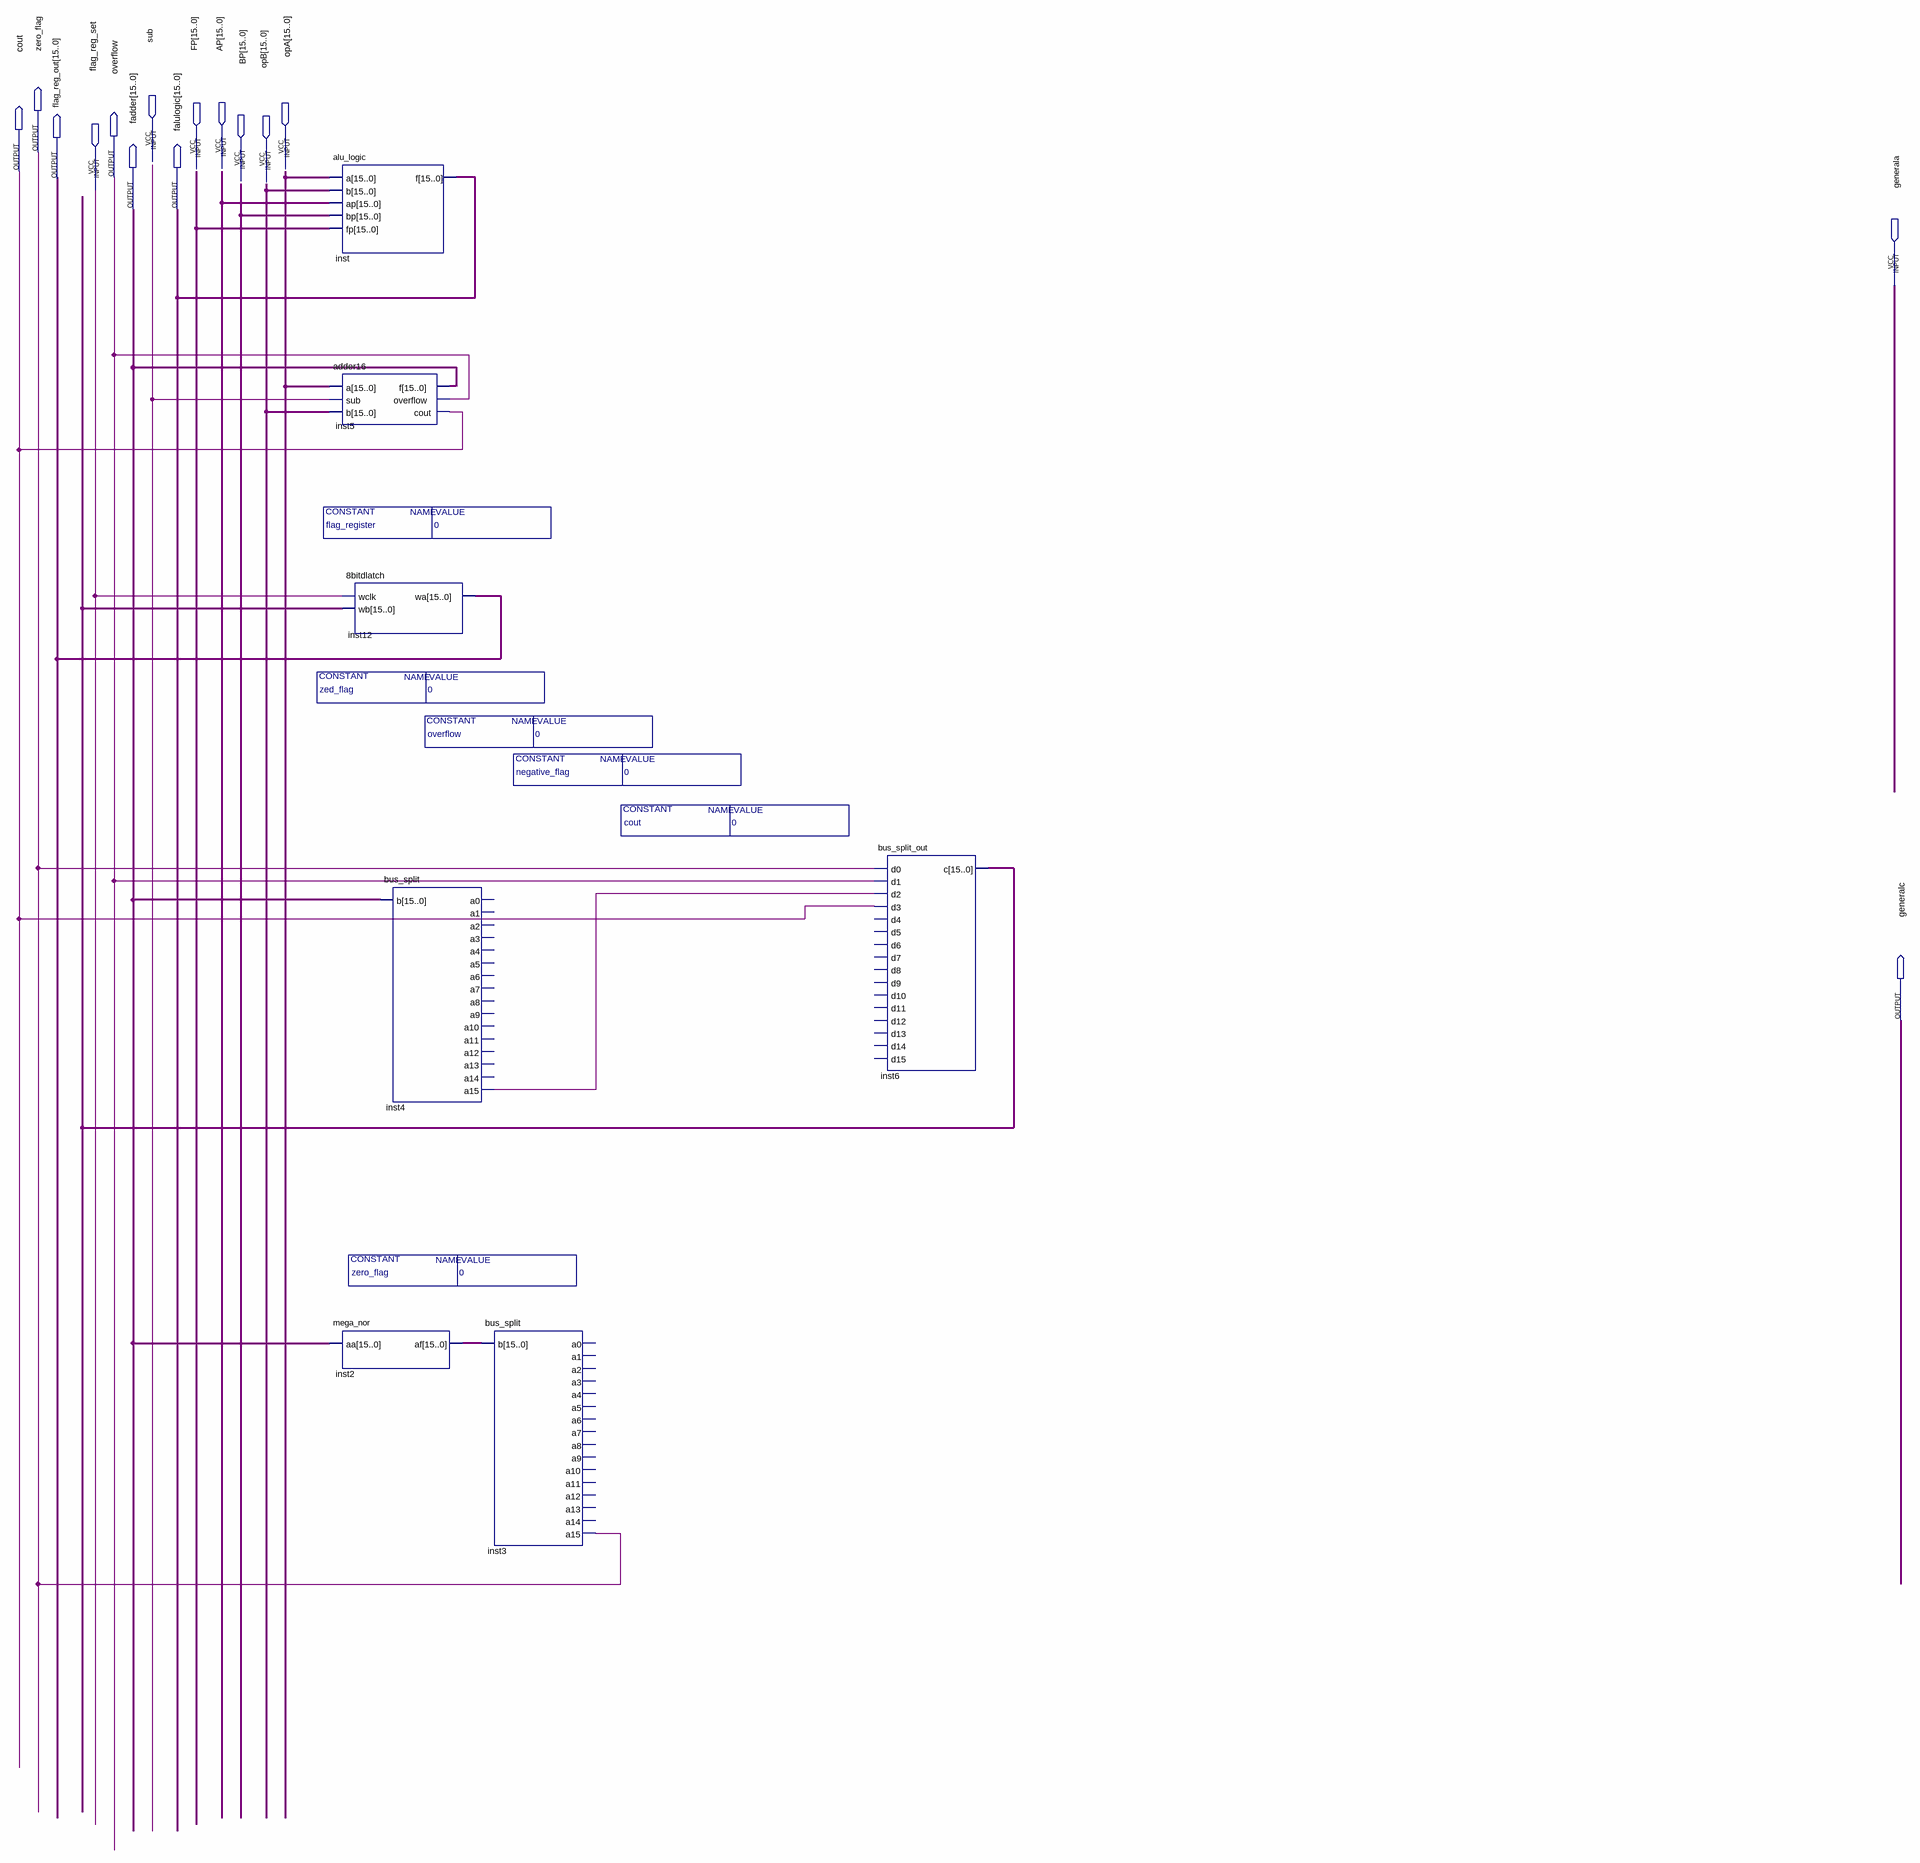
[diagram p0: schematic sheet]
// Quartus schematic alumod.bdf as structural Verilog: 7 symbols, 15 pins
module alumod #(parameter flag_register = 0, parameter zero_flag = 0, parameter negative_flag = 0, parameter overflow = 0, parameter cout = 0, parameter zed_flag = 0) (
  input  sub,
  input  [15:0] FP,
  input  [15:0] AP,
  input  [15:0] opA,
  input  [15:0] BP,
  input  [15:0] opB,
  input  flag_reg_set,
  input  generala,
  output zero_flag,
  output cout,
  output [15:0] flag_reg_out,
  output overflow,
  output [15:0] fadder,
  output [15:0] falulogic,
  output generalc
);

  wire inst4_a15;
  wire [15:0] inst2_af, inst6_c;

  alu_logic inst (.a(opA), .b(opB), .ap(AP), .bp(BP), .fp(FP), .f(falulogic));
  adder16 inst5 (.a(opA), .sub(sub), .b(opB), .f(fadder), .overflow(overflow), .cout(cout));
  \8bitdlatch  inst12 (.wclk(flag_reg_set), .wb(inst6_c), .wa(flag_reg_out));
  mega_nor inst2 (.aa(fadder), .af(inst2_af));
  bus_split inst4 (
    .b(fadder), .a15(inst4_a15));  // open: a0, a1, a2, a3, a4, a5, a6, a7, a8, a9, a10, a11, a12, a13, a14
  bus_split inst3 (
    .b(inst2_af), .a15(zero_flag));  // open: a0, a1, a2, a3, a4, a5, a6, a7, a8, a9, a10, a11, a12, a13, a14
  bus_split_out inst6 (
    .d0(zero_flag), .d1(overflow), .d2(inst4_a15), .d3(cout), .c(inst6_c));  // open: d4, d5, d6, d7, d8, d9, d10, d11, d12, d13, d14, d15
endmodule
